# Altium project stm8电压表 v1.1.PrjPCB
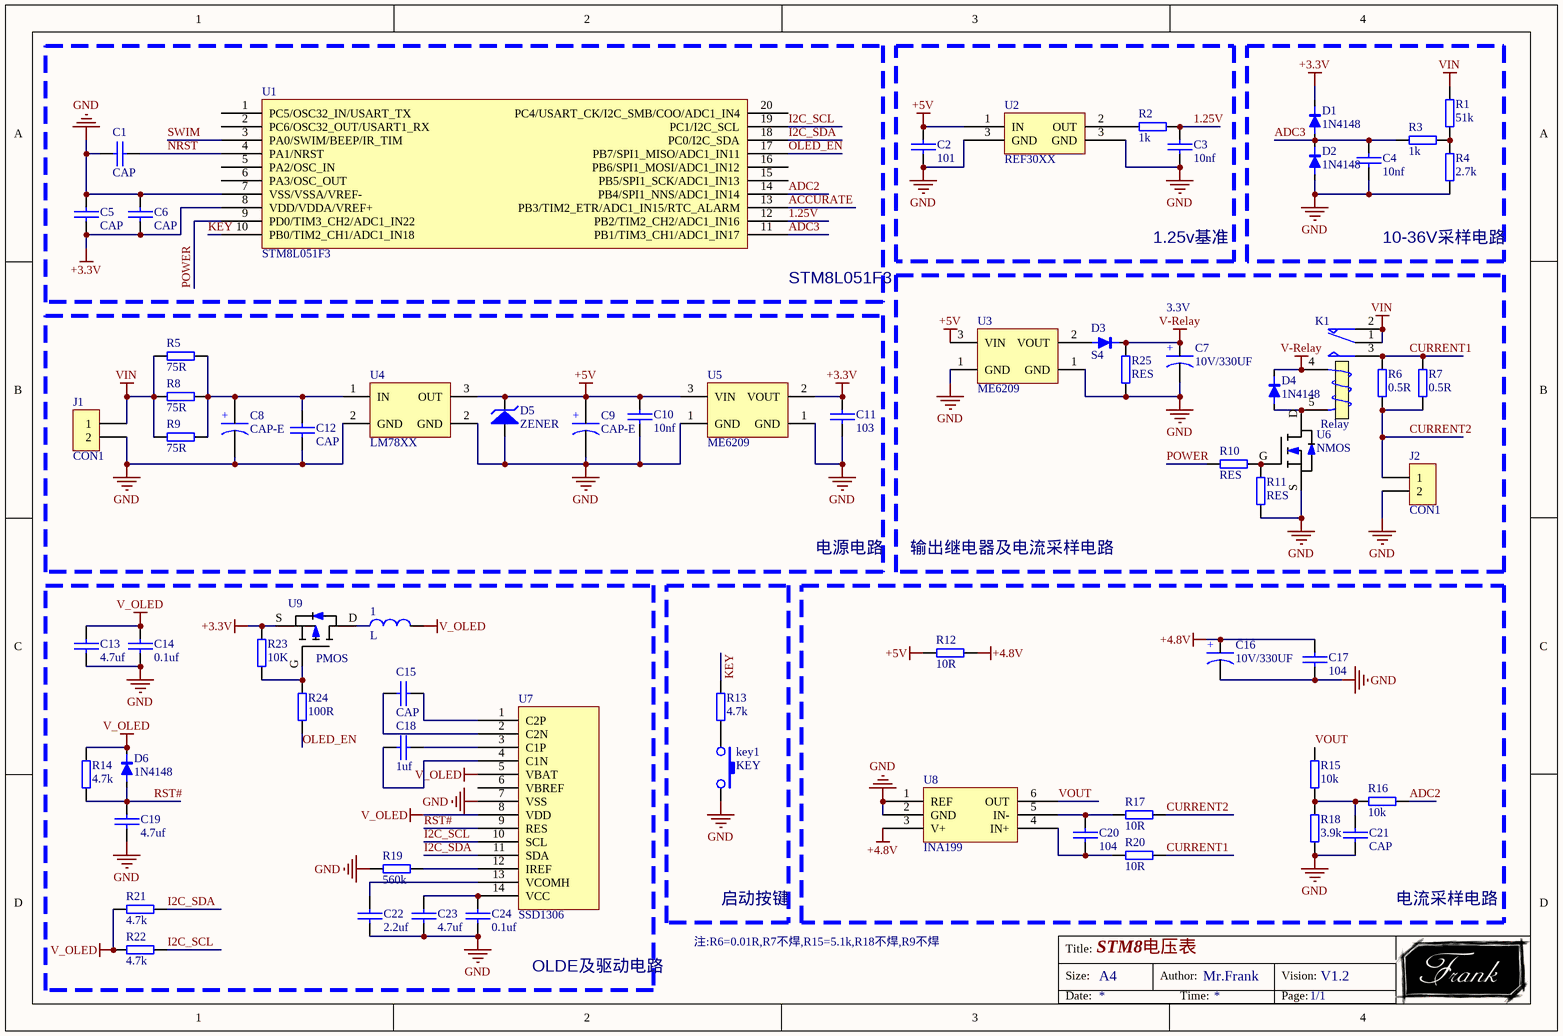
[diagram p0: stm8电压表.SchDoc]
1 sheet, 69 parts. Net scope: global (net labels, ports and power ports of the same name join across sheets).
Board file: PCB1.PcbDoc

## Sheet stm8电压表.SchDoc: STM8电压表
size A4; DrawnBy: V1.2; Engineer: 2; Organization: 0; SheetNumber: 1/1; ImagePath: 2

### Parts
1  L  [0603-R]
C1  CAP  [0603-c]
C2  101  [0603-c]
C3  10nf  [0603-c]
C4  10nf  [0603-c]
C5  CAP  [0603-c]
C6  CAP  [0603-c]
C7  10V/330UF  [SMD-EC-F6.3]
C8  CAP-E  [0.1UF]
C9  CAP-E  [SMD-EC-F5]
C10  10nf  [0603-c]
C11  103  [0603-c]
C12  CAP  [0603-c]
C13  4.7uf  [0603-c]
C14  0.1uf  [0603-c]
C15  CAP  [0603-c]
C16  10V/330UF  [SMD-EC-F3]
C17  104  [0603-c]
C18  1uf  [0603-c]
C19  4.7uf  [0603-c]
C20  104  [0603-c]
C21  CAP  [0603-c]
C22  2.2uf  [0603-c]
C23  4.7uf  [0603-c]
C24  0.1uf  [0603-c]
D1  1N4148  [SOD-323]
D2  1N4148  [SOD-323]
D3  S4  [SOD-323]
D4  1N4148  [SOD-323]
D5  ZENER  [2512-d]
D6  1N4148  [SOD-323]
J1  CON1  [SIP2]
J2  CON1  [SIP2]
K1  Relay  [继电器10.5*15.5]
key1  KEY  [按钮2]
R1  51k  [0603-r]
R2  1k  [0603-r]
R3  1k  [0603-r]
R4  2.7k  [0603-r]
R5  75R  [2512-d]
R6  0.5R  [2512-D]
R7  0.5R  [2512-D]
R8  75R  [2512-d]
R9  75R  [2512-d]
R10  RES  [0603-r]
R11  RES  [0603-r]
R12  10R  [0603-r]
R13  4.7k  [0603-r]
R14  4.7k  [0603-r]
R15  10k  [0603-r]
R16  10k  [0603-r]
R17  10R  [0603-r]
R18  3.9k  [0603-r]
R19  560k  [0603-r]
R20  10R  [0603-r]
R21  4.7k  [0603-r]
R22  4.7k  [0603-r]
R23  10K  [0603-r]
R24  100R  [0603-r]
R25  RES  [0603-r]
U1  STM8L051F3  [TSSOP-20]
U2  REF30XX  [SOT23]
U3  ME6209  [SOT23]
U4  LM78XX  [TO-252]
U5  ME6209  [SOT23]
U6  NMOS  [SOT23]
U7  SSD1306  [OLED 0.91寸(裸屏)]
U8  INA199  [SOT-363]
U9  PMOS  [SOT23]

### Blocks framed on the sheet
STM8L051F3: C1 C5 C6 U1
1.25v基准: C2 C3 R2 U2
10-36V采样电路: C4 D1 D2 R1 R3 R4
输出继电器及电流采样电路: C7 D3 D4 J2 K1 R6 R7 R10 R11 R25 U3 U6
电源电路: C8-C12 D5 J1 R5 R8 R9 U4 U5
OLDE及驱动电路: 1 C13-C15 C18 C19 C22-C24 D6 R14 R19 R21-R24 U7 U9
启动按键: key1 R13
电流采样电路: C16 C17 C20 C21 R12 R15-R18 R20 U8

### Nets
+3.3V: C5.2 C6.2 C11.1 D1.K R23.2 U1.8(VDD/VDDA/VREF+) U5.2(VOUT) U9.S
+4.8V: C16.1(A) C17.2 R12.2 U8.3(V+)
+5V: C2.1 C9.1(A) C10.1 D5.2(K) R12.1 U2.1(IN) U3.3(VIN) U4.3(OUT) U5.3(VIN)
GND: C1.1 C2.2 C3.2 C4.2 C5.1 C6.1 C7.2(C) C8.2(C) C9.2(C) C10.2 C11.2 C12.2 C13.1 C14.1 C16.2(C) C17.1 C19.1 C21.2 C22.1 C23.1 C24.1 D2.A D5.1(A) J1.2 J2.2 key1.2 R4.1 R11.1 R18.2 R19.2 R25.1 U1.7(VSS/VSSA/VREF-) U2.3(GND) U3.1(GND) U4.2(GND) U5.1(GND) U6.S U7.7(VSS) U8.1(REF) U8.2(GND)
V-Relay: C7.1(A) D3.K D4.K K1.4(T1) R25.2
V_OLED: 1.1 C13.2 C14.2 D6.K R14.1 R21.1 R22.1 U7.5(VBAT) U7.8(VDD)
VIN: J1.1 K1.1(COM) K1.2(NC) R1.1 R5.1 R8.1 R9.1
1.25V: C3.1 R2.2 U1.12(PB2/TIM2_CH2/ADC1_IN16)
ACCURATE: U1.13(PB3/TIM2_ETR/ADC1_IN15/RTC_ALARM)
ADC2: R16.2 U1.14(PB4/SPI1_NNS/ADC1_IN14)
ADC3: C4.1 D1.A D2.K R3.2 U1.11(PB1/TIM3_CH1/ADC1_IN17)
CURRENT1: K1.3(NO) R6.2 R7.2 R20.2
CURRENT2: J2.1 R6.1 R7.1 R17.2
I2C_SCL: R22.2 U1.19(PC1/I2C_SCL) U7.10(SCL)
I2C_SDA: R21.2 U1.18(PC0/I2C_SDA) U7.11(SDA)
KEY: R13.1 U1.10(PB0/TIM2_CH1/ADC1_IN18)
NRST: C1.2 U1.4(PA1/NRST)
OLED_EN: R24.1 U1.17(PB7/SPI1_MISO/ADC1_IN11)
POWER: R10.1 U1.9(PD0/TIM3_CH2/ADC1_IN22)
RST#: C19.2 D6.A R14.2 U7.9(RES)
SWIM: U1.3(PA0/SWIM/BEEP/IR_TIM)
VOUT: R15.1 U8.6(OUT)
Net1_2: 1.2 U9.D
NetC8_1: C8.1(A) C12.1 R5.2 R8.2 R9.2 U4.1(IN)
NetC15_1: C15.1 U7.2(C2N)
NetC15_2: C15.2 U7.1(C2P)
NetC18_1: C18.1 U7.4(C1N)
NetC18_2: C18.2 U7.3(C1P)
NetC20_1: C20.1 R20.1 U8.4(IN+)
NetC20_2: C20.2 R17.1 U8.5(IN-)
NetC21_1: C21.1 R15.2 R16.1 R18.1
NetC22_2: C22.2 U7.13(VCOMH)
NetC23_2: C23.2 C24.2 U7.14(VCC)
NetD3_A: D3.A U3.2(VOUT)
NetD4_A: D4.A K1.5(T2) U6.D
Netkey1_1: key1.1 R13.2
NetR1_2: R1.2 R3.1 R4.2
NetR2_1: R2.1 U2.2(OUT)
NetR10_2: R10.2 R11.2 U6.G
NetR19_1: R19.1 U7.12(IREF)
NetR23_1: R23.1 R24.2 U9.G

Not connected (* = marked no-connect by the designer): U1 1(PC5/OSC32_IN/USART_TX) 2(PC6/OSC32_OUT/USART1_RX) 5(PA2/OSC_IN) 6(PA3/OSC_OUT) 15(PB5/SPI1_SCK/ADC1_IN13) 16(PB6/SPI1_MOSI/ADC1_IN12) 20(PC4/USART_CK/I2C_SMB/COO/ADC1_IN4); U7 6(VBREF)

### Notes on the sheet
- 3.3V
- 注:R6=0.01R,R7不焊,R15=5.1k,R18不焊,R9不焊
- Title:
- Size:
- A4
- Author:
- Mr.Frank
- Vision:
- Date:
- Time:
- Page:
- (in symbol CAP-E) +

### Library data of the parts
C2-C4 C10 C11 C13 C14 C17-C20 C22-C24 = CAP
C7 C16 = CAP-E
D1-D4 D6 = DIODE1: pin to pad: A>1 K>2
J1 J2 = CON2
K1 = Relay: SPDT Relay; pin to pad: 2>3 3>2; Published: 8-Jun-2000; LatestRevisionDate: 17-Jul-2002; LatestRevisionNote: Re-released for DXP Platform.; PackageReference: MODULE5B; Publisher: Altium Limited
R1-R9 R12-R24 = RES
U3 U5 = ME6209: pin to pad: 2>3 3>2
U6 = NMOS: pin to pad: D>2 G>1 S>3
U7 = SSD1306: OLED屏幕
U9 = PMOS: pin to pad: D>3 G>1 S>2